# EAGLE design dongle (EAGLE 6.4)
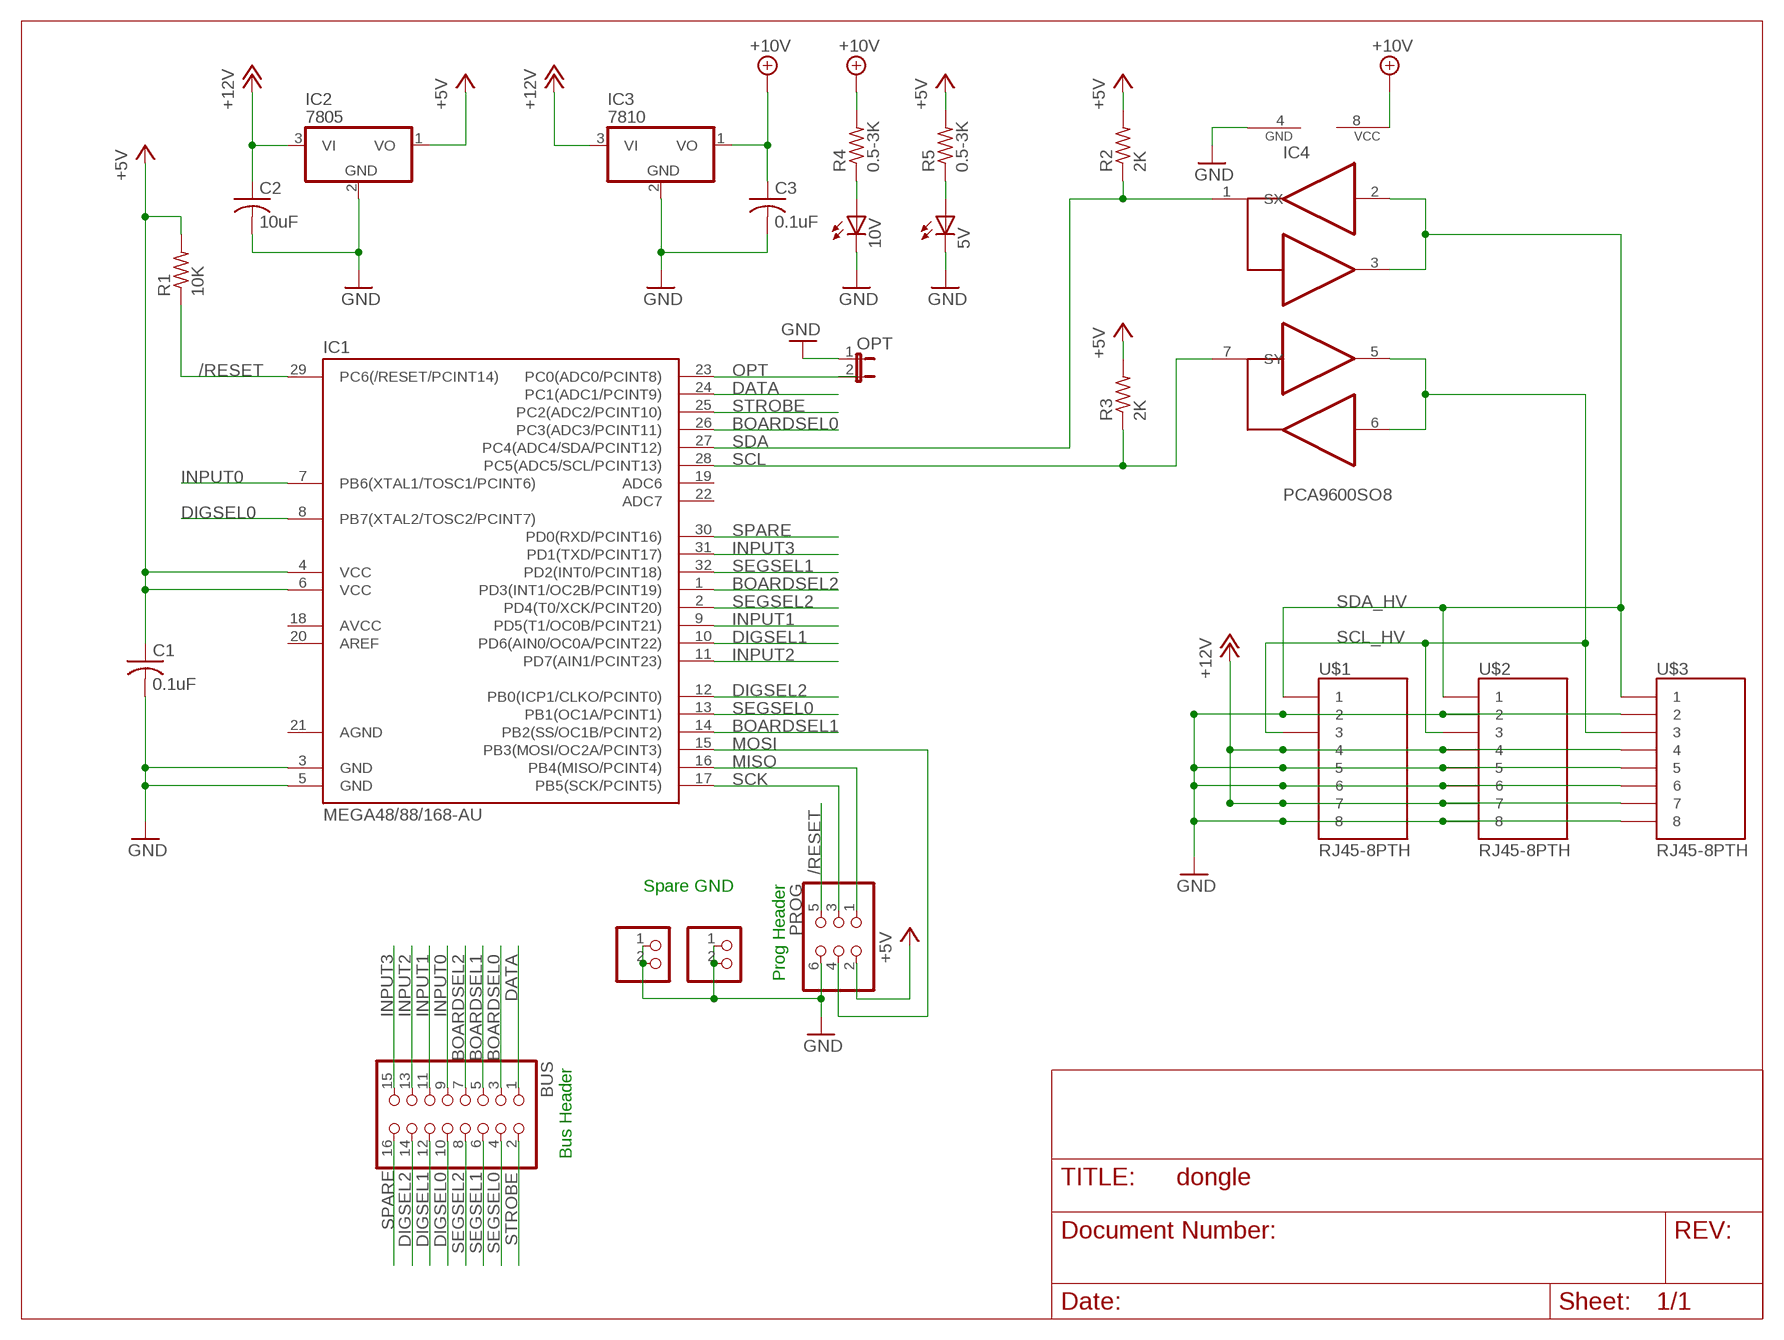
[diagram p0: schematic, sheet 1]

## Parts
5V  LED3MM  [LED3MM]
10V  LED3MM  [LED3MM]
BUS  PINHD-2X8  [2X08]
C1  0.1uF  C-US025-025X050  [C025-025X050]
C2  10uF  C-US025-025X050  [C025-025X050]
C3  0.1uF  C-US025-025X050  [C025-025X050]
GROUND1  PINHD-1X2  [1X02]
GROUND2  PINHD-1X2  [1X02]
IC1  MEGA48/88/168-AU  [TQFP32-08]
IC2  7805  78L05Z  [TO92]
IC3  7810  78L05Z  [TO92]
IC4  PCA9600SO8  [SO08]
OPT  JUMPER-2PTH  [1X02]
PROG  PINHD-2X3  [2X03]
R1  10K  R-US_0204/5  [0204/5]
R2  2K  R-US_0204/5  [0204/5]
R3  2K  R-US_0204/5  [0204/5]
R4  0.5-3K  R-US_0204/5  [0204/5]
R5  0.5-3K  R-US_0204/5  [0204/5]
U$1  RJ45-8PTH  [RJ45-8]
U$2  RJ45-8PTH  [RJ45-8]
U$3  RJ45-8PTH  [RJ45-8]

## Nets
+5V [power]: C1.1 IC1.4(VCC) IC1.6(VCC) IC2.1(VO) PROG.2 R1.2 R2.2 R3.2 R5.2
+10V [power]: C3.1 IC3.1(VO) IC4.8(VCC) R4.2
+12V [power]: C2.1 IC2.3(VI) IC3.3(VI) U$1.4 U$1.7 U$2.4 U$2.7 U$3.4 U$3.7
/RESET: IC1.29(PC6(/RESET/PCINT14)) PROG.5 R1.1
BOARDSEL0: BUS.3 IC1.26(PC3(ADC3/PCINT11))
BOARDSEL1: BUS.5 IC1.14(PB2(SS/OC1B/PCINT2))
BOARDSEL2: BUS.7 IC1.1(PD3(INT1/OC2B/PCINT19))
DATA: BUS.1 IC1.24(PC1(ADC1/PCINT9))
DIGSEL0: BUS.10 IC1.8(PB7(XTAL2/TOSC2/PCINT7))
DIGSEL1: BUS.12 IC1.10(PD6(AIN0/OC0A/PCINT22))
DIGSEL2: BUS.14 IC1.12(PB0(ICP1/CLKO/PCINT0))
GND [power]: 5V.K(C) 10V.K(C) C1.2 C2.2 C3.2 GROUND1.1 GROUND1.2 GROUND2.1 GROUND2.2 IC1.3(GND) IC1.5(GND) IC2.2(GND) IC3.2(GND) IC4.4(GND) OPT.1 PROG.6 U$1.2 U$1.5 U$1.6 U$1.8 U$2.2 U$2.5 U$2.6 U$2.8 U$3.2 U$3.5 U$3.6 U$3.8
INPUT0: BUS.9 IC1.7(PB6(XTAL1/TOSC1/PCINT6))
INPUT1: BUS.11 IC1.9(PD5(T1/OC0B/PCINT21))
INPUT2: BUS.13 IC1.11(PD7(AIN1/PCINT23))
INPUT3: BUS.15 IC1.31(PD1(TXD/PCINT17))
MISO: IC1.16(PB4(MISO/PCINT4)) PROG.1
MOSI: IC1.15(PB3(MOSI/OC2A/PCINT3)) PROG.4
N$1: 5V.A R5.1
N$2: 10V.A R4.1
OPT: IC1.23(PC0(ADC0/PCINT8)) OPT.2
SCK: IC1.17(PB5(SCK/PCINT5)) PROG.3
SCL: IC1.28(PC5(ADC5/SCL/PCINT13)) IC4.7(SY) R3.1
SCL_HV: IC4.5(TY) IC4.6(RY) U$1.3 U$2.3 U$3.3
SDA: IC1.27(PC4(ADC4/SDA/PCINT12)) IC4.1(SX) R2.1
SDA_HV: IC4.2(RX) IC4.3(TX) U$1.1 U$2.1 U$3.1
SEGSEL0: BUS.4 IC1.13(PB1(OC1A/PCINT1))
SEGSEL1: BUS.6 IC1.32(PD2(INT0/PCINT18))
SEGSEL2: BUS.8 IC1.2(PD4(T0/XCK/PCINT20))
SPARE: BUS.16 IC1.30(PD0(RXD/PCINT16))
STROBE: BUS.2 IC1.25(PC2(ADC2/PCINT10))
Unconnected: IC1.18(AVCC) IC1.19(ADC6) IC1.20(AREF) IC1.22(ADC7)

## Notes on the sheet
- Spare GND
- Prog Header
- Bus Header

## Power pins joined to a net without a drawn wire
AGND: IC1.21(AGND)

## Library data of the parts
5V 10V = led:LED: LED OSRAM: - CHIPLED LG R971, LG N971, LY N971, LG Q971, LY Q971, LO R971, LY R971 LH N974, LH R974 LS Q976, LO Q976, LY Q976 LO Q996 - Hyper CHIPLED LW Q18S LB Q993, LB Q99A, LB R99A - SideLED LS A670, LO A670, LY A670, LG A670, LP A670 LB A673, LV A673, LT A673, LW A673 LH A674 LY A675 LS A676, LA A676, LO A676, LY A676, LW A676 LS A679, LY A679, LG A679 - Hyper Micro SIDELED® LS Y876, LA Y876, LO Y876, LY Y876 LT Y87S - SmartLED LW L88C, LW L88S LB L89C, LB L89S, LG L890 LS L89K, LO L89K, LY L89K LS L896, LA L896, LO L896, LY L896 - TOPLED LS T670, LO T670, LY T670, LG T670, LP T670 LSG T670, LSP T670, LSY T670, LOP T670, LYG T670 LG T671, LOG T671, LSG T671 LB T673, LV T673, LT T673, LW T673 LH T674 LS T676, LA T676, LO T676, LY T676, LB T676, LH T676, LSB T676, LW T676 LB T67C, LV T67C, LT T67C, LS T67K, LO T67K, LY T67K, LW E67C LS E67B, LA E67B, LO E67B, LY E67B, LB E67C, LV E67C, LT E67C LW T67C LS T679, LY T679, LG T679 LS T770, LO T770, LY T770, LG T770, LP T770 LB T773, LV T773, LT T773, LW T773 LH T774 LS E675, LA E675, LY E675, LS T675 LS T776, LA T776, LO T776, LY T776, LB T776 LHGB T686 LT T68C, LB T68C - Hyper Mini TOPLED® LB M676 - Mini TOPLED Santana® LG M470 LS M47K, LO M47K, LY M47K Source: http://www.osram.convergy.de LUXEON: - LUMILED® LXK2-PW12-R00, LXK2-PW12-S00, LXK2-PW14-U00, LXK2-PW14-V00 LXK2-PM12-R00, LXK2-PM12-S00, LXK2-PM14-U00 LXK2-PE12-Q00, LXK2-PE12-R00, LXK2-PE12-S00, LXK2-PE14-T00, LXK2-PE14-U00 LXK2-PB12-K00, LXK2-PB12-L00, LXK2-PB12-M00, LXK2-PB14-N00, LXK2-PB14-P00, LXK2-PB14-Q00 LXK2-PR12-L00, LXK2-PR12-M00, LXK2-PR14-Q00, LXK2-PR14-R00 LXK2-PD12-Q00, LXK2-PD12-R00, LXK2-PD12-S00 LXK2-PH12-R00, LXK2-PH12-S00 LXK2-PL12-P00, LXK2-PL12-Q00, LXK2-PL12-R00 Source: www.luxeon.com KINGBRIGHT: KA-3528ASYC Source: www.kingbright.com
BUS = pinhead:PINHD-2X8: PIN HEADER
C1-C3 = rcl:C-US: CAPACITOR, American symbol
GROUND1 GROUND2 = pinhead:PINHD-1X2: PIN HEADER
IC1 = avr-4:MEGA48/88/168
IC2 IC3 = linear:78*: Positive VOLTAGE REGULATOR Source: http://cache.national.com/ds/LM/LM78L05.pdf http://www.fairchildsemi.com/ds/LM/LM7805.pdf
IC4 = 4534_I2C2:PCA9600: I2C ACTIVE TERMINATOR SO-8
OPT = SparkFun:JUMPER-2: Jumper Basic 0.1" spaced jumper. Use with breakaway headers.
PROG = pinhead:PINHD-2X3: PIN HEADER
R1-R5 = rcl:R-US_: RESISTOR, American symbol
U$1-U$3 = SparkFun:RJ45-8: RJ45 Jack Simple RJ45, 8-pin connection - connector for common Cat5, Cat5e, and Cat6 Ethernet cables. Footprint not yet proven in production. Connector sku is PRT-00643; Breakout PCB sku is BOB-00716.

## Net classes
0 default: width 0.152 mm, drill 0.152 mm, clearance 0.152 mm
1 power: width 0.305 mm, drill 0.305 mm, clearance 0.152 mm to class 0, clearance 0.152 mm

## Board
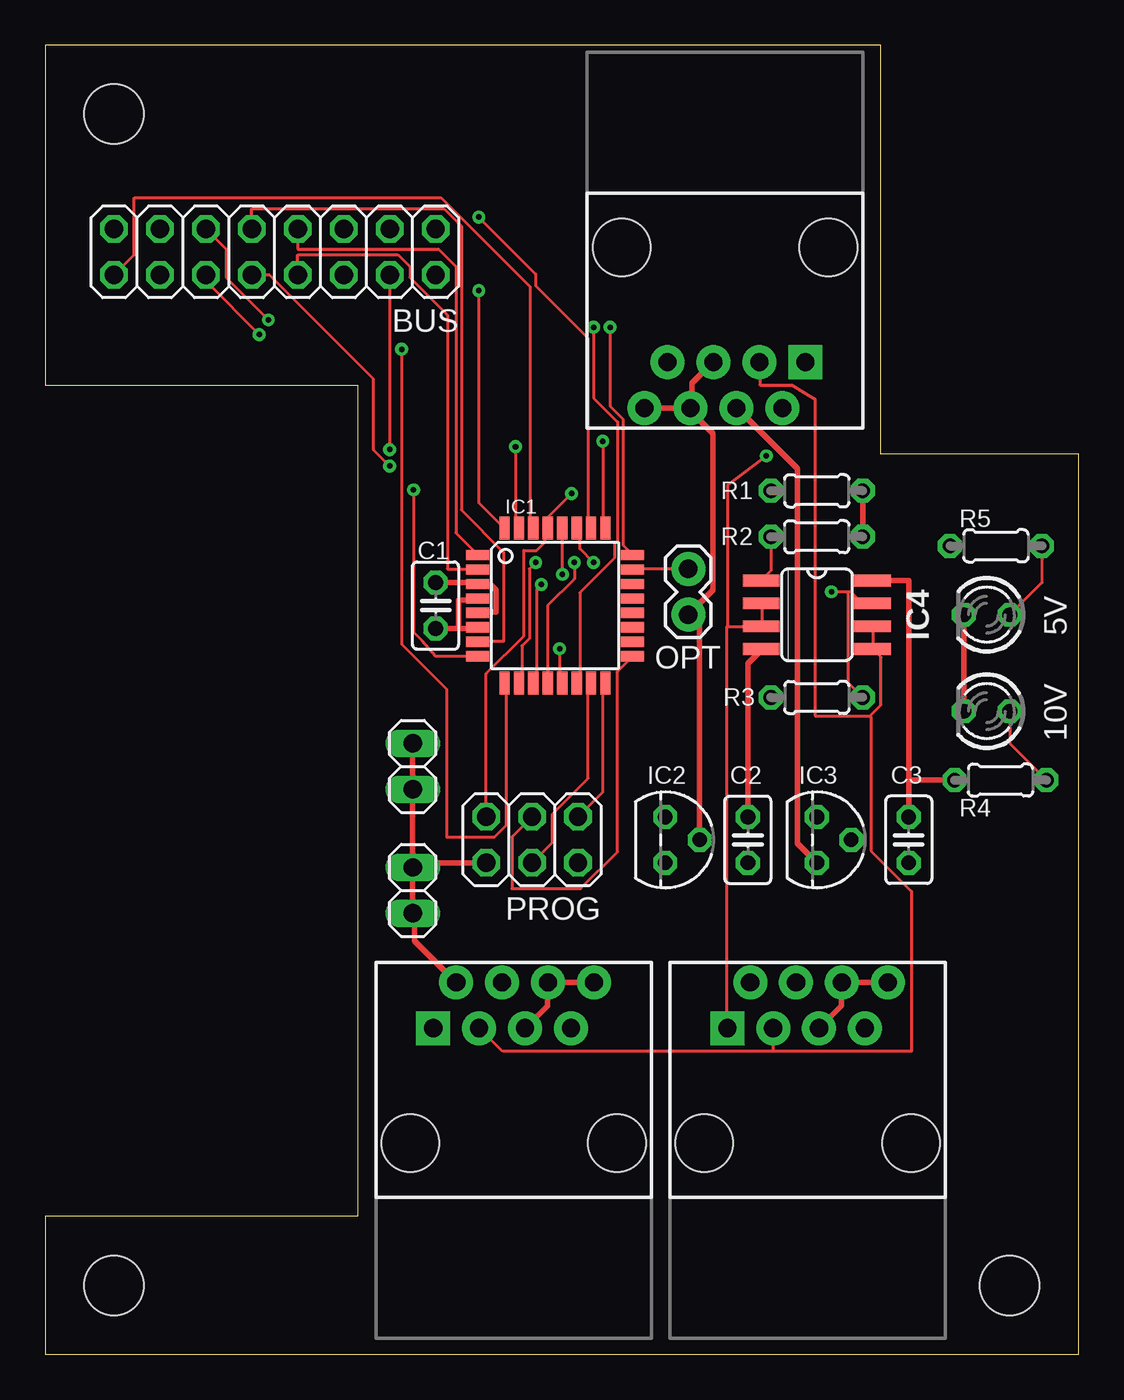
[diagram p1: board, top side]
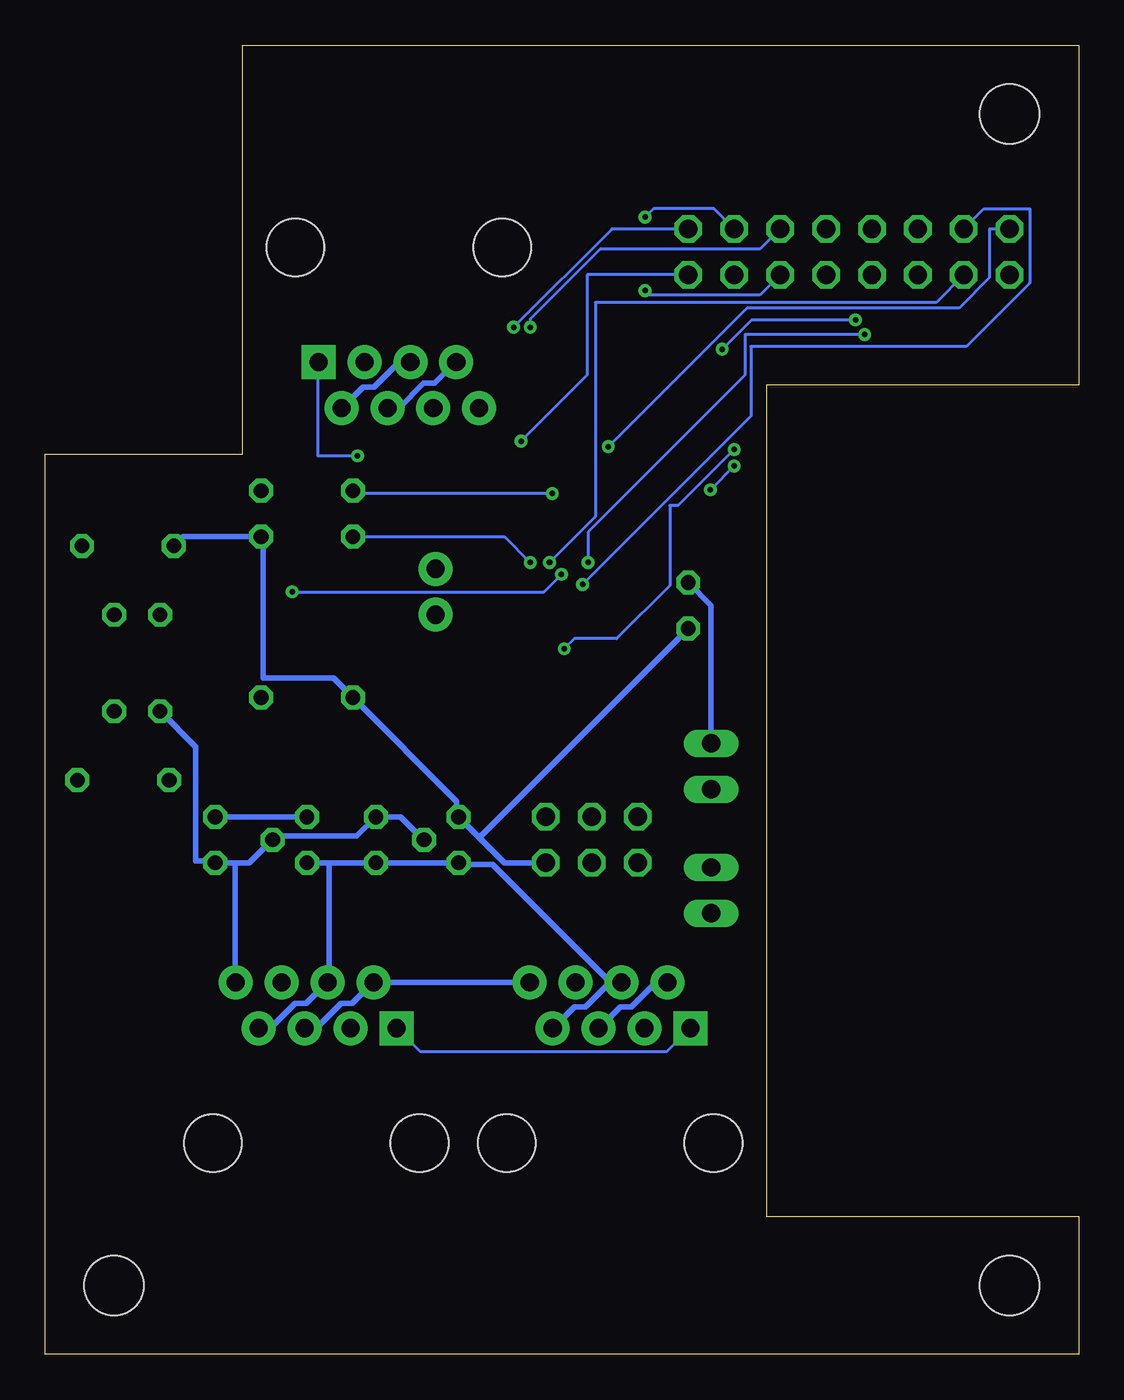
[diagram p2: board, bottom side, seen from below]

Size 57.15 x 72.39 mm. Coordinates in mm from the lower left corner, seen from the top.
Outline: 0,0 57.15,0 57.15,49.78 46.23,49.78 46.23,72.39 0,72.39 0,53.59 17.27,53.59 17.27,7.62 0,7.62 0,0
Copper layers (1*16): Top 0.035mm / dielectric 1.5mm / Bottom 0.035mm
Design rules "default *": minimum track width 6mil, minimum drill 12mil, track to track 6mil, track to pad 10mil, pad to pad 8mil, via to via 8mil, smd to smd 6mil, copper to edge 30mil, drill to drill 8mil, minimum pad ring 10mil, minimum via ring 8mil, stop-mask expansion 4mil, vias tented up to drill 13mil, thermal gap 10mil
tRestrict: area 14.7,35.8 to 21.8,36.6
vRestrict: area 2,57.7 to 23.6,64.3

### Footprints (pad centres in the part's own frame; a part is rotated, then mirrored left to right if it is on the bottom)
LED3MM = drill 0.813 octagon: A -1.27,0; K 1.27,0
2X08 = drill 1.016 octagon: 1 -8.89,-1.27; 2 -8.89,1.27; 3 -6.35,-1.27; 4 -6.35,1.27; 5 -3.81,-1.27; 6 -3.81,1.27; 7 -1.27,-1.27; 8 -1.27,1.27; 9 1.27,-1.27; 10 1.27,1.27; 11 3.81,-1.27; 12 3.81,1.27; 13 6.35,-1.27; 14 6.35,1.27; 15 8.89,-1.27; 16 8.89,1.27
C025-025X050 = drill 0.813 octagon: 1 -1.27,0; 2 1.27,0
1X02 = drill 1.016 long: 1 -1.27,0; 2 1.27,0
TQFP32-08 = smd 1.27 x 0.559: 1 -4.293,2.8; 2 -4.293,2; 3 -4.293,1.2; 4 -4.293,0.4; 5 -4.293,-0.4; 6 -4.293,-1.2; 7 -4.293,-2; 8 -4.293,-2.8; 17 4.293,-2.8; 18 4.293,-2; 19 4.293,-1.2; 20 4.293,-0.4; 21 4.293,0.4; 22 4.293,1.2; 23 4.293,2; 24 4.293,2.8 | smd 0.559 x 1.27: 9 -2.8,-4.293; 10 -2,-4.293; 11 -1.2,-4.293; 12 -0.4,-4.293; 13 0.4,-4.293; 14 1.2,-4.293; 15 2,-4.293; 16 2.8,-4.293; 25 2.8,4.293; 26 2,4.293; 27 1.2,4.293; 28 0.4,4.293; 29 -0.4,4.293; 30 -1.2,4.293; 31 -2,4.293; 32 -2.8,4.293
TO92 = drill 0.813 octagon: 1 -1.27,0; 2 0,1.905; 3 1.27,0
SO08 = smd 0.66 x 2.032: 1 -1.905,-3.073; 2 -0.635,-3.073; 3 0.635,-3.073; 4 1.905,-3.073; 5 1.905,3.073; 6 0.635,3.073; 7 -0.635,3.073; 8 -1.905,3.073
1X02' = drill 1.016 pad 1.88: 1 0,0; 2 2.54,0
2X03 = drill 1.016 octagon: 1 -2.54,-1.27; 2 -2.54,1.27; 3 0,-1.27; 4 0,1.27; 5 2.54,-1.27; 6 2.54,1.27
0204/5 = drill 0.813 octagon: 1 -2.54,0; 2 2.54,0
RJ45-8 = drill 1 pad 1.88 square: 1 -4.445,6.35 | drill 1 pad 1.88: 2 -3.175,8.89; 3 -1.905,6.35; 4 -0.635,8.89; 5 0.635,6.35; 6 1.905,8.89; 7 3.175,6.35; 8 4.445,8.89 | hole 3.2: -5.715,0; 5.715,0
STAND-OFF = hole 3.302: 0,0

### Placement (x,y rotation side)
5V  52.07,40.89 180 top
10V  52.07,35.56 180 top
BUS  12.7,60.96 180 top
C1  21.59,41.4 90 top
C2  38.86,28.45 90 top
C3  47.75,28.45 270 top
GROUND1  20.32,25.65 90 top
GROUND2  20.32,32.51 90 top
IC1  28.19,41.4 0 top
IC2  34.29,28.45 270 top
IC3  42.67,28.45 270 top
IC4  42.67,40.89 270 top
OPT  [1X02']  35.56,40.89 90 top
PROG  26.92,28.45 180 top
R1  42.67,47.75 0 top
R2  42.67,45.21 0 top
R3  42.67,36.32 180 top
R4  52.83,31.75 180 top
R5  52.58,44.7 180 top
U$1  42.16,11.68 0 top
U$2  37.59,61.21 180 top
U$3  25.91,11.68 0 top
U$5  [STAND-OFF]  3.81,68.58 0 top
U$6  [STAND-OFF]  3.81,3.81 0 top
U$7  [STAND-OFF]  53.34,3.81 0 top

### Tracks (layer width: path | path; a pad name or v marks a point on that pad's centre or on a via)
+5V
  Top 0.305: R1.2 R2.2 | 23.93,41.81 IC1.4 23.77,41.71 22.86,41.71 22.86,40.13 | 23.93,40.23 IC1.6 23.77,40.13 22.86,40.13 | C1.1 22.86,40.13
  Bottom 0.305: R5.2 49.53,45.21 R2.2 45.11,45.11 45.11,37.39 41.2,37.39 R3.2 34.39,30.58 34.39,29.82 IC2.1 33.17,28.6 | 33.17,28.6 31.75,27.18 PROG.2 | C1.1 33.02,28.7 33.07,28.7 33.17,28.6
+10V
  Top 0.305: C3.1 47.75,31.75 | 47.75,31.75 47.75,42.77 45.77,42.77 IC4.8 | 47.75,31.75 R4.2
  Bottom 0.305: C3.1 IC3.1
+12V
  Top 0.305: IC3.3 41.6,28.25 41.6,48.97 38.25,52.32 U$2.4
  Bottom 0.305: U$2.4 37.59,52.32 36.22,53.7 35.61,53.7 34.44,54.86 U$2.7 | U$3.7 29.06,18.03 27.89,19.2 27.28,19.2 25.91,20.57 U$3.4 26.01,20.68 32.41,27.08 34.19,27.08 IC2.3 C2.1 41.45,27.18 | 41.45,27.18 IC3.3 | U$1.7 44.7,18.03 43.33,19.41 42.72,19.41 41.55,20.57 U$1.4 41.45,20.68 41.45,27.18
/RESET  (via drill 0.3)
  Top 0.152: PROG.5 24.38,37.64 26.47,39.73 26.47,44.45 27.18,44.45 27.64,44.91 27.64,45.52 27.79,45.67 IC1.29 27.79,45.77 27.79,46.28 v29.11,47.6
  Bottom 0.152: R1.1 39.98,47.6 v29.11,47.6
BOARDSEL0  (via drill 0.3)
  Top 0.152: v23.98,62.89 27.13,59.74 27.13,59.08 30.02,56.19 30.02,45.87 30.18,45.72 IC1.26
  Bottom 0.152: v23.98,62.89 23.52,63.35 20.17,63.35 BUS.3
BOARDSEL1  (via drill 0.3)
  Top 0.152: v30.33,56.79 30.33,52.88 31.65,51.56 31.65,44.96 31.5,44.81 31.5,44.04 29.57,42.11 29.57,37.29 29.41,37.13 IC1.14
  Bottom 0.152: v30.33,56.79 30.33,57.25 26.47,61.11 17.63,61.11 BUS.5
BOARDSEL2
  Top 0.152: BUS.7 13.97,61.11 21.74,61.11 22.71,60.15 22.71,45.41 23.88,44.25 IC1.1
DATA  (via drill 0.3)
  Top 0.152: v31.24,56.79 31.24,52.43 31.95,51.71 31.95,44.76 32.46,44.25 IC1.24
  Bottom 0.152: v31.24,56.79 25.81,62.23 BUS.1
DIGSEL0  (via drill 0.3)
  Top 0.152: v20.37,47.8 20.37,39.93 20.83,39.47 21.59,38.61 23.88,38.61 IC1.8 | v19.05,49.12 18.14,50.04 18.14,53.95 12.39,59.69 BUS.10
  Bottom 0.152: v19.05,49.12 v20.37,47.8
DIGSEL1  (via drill 0.3)
  Top 0.152: v27.13,43.79 26.77,43.43 26.77,39.57 26.36,39.17 26.36,37.29 26.21,37.13 IC1.10 | v11.84,56.39 8.89,59.33 BUS.12
  Bottom 0.152: v27.13,43.79 27.13,45.47 18.44,54.15 18.44,56.39 v11.84,56.39
DIGSEL2  (via drill 0.3)
  Top 0.152: v29.26,43.79 29.26,42.88 27.79,41.4 27.79,37.13 IC1.12
  Bottom 0.152: v29.26,43.79 26.72,46.33 26.72,58.17 7.87,58.17 BUS.14
GND
  Top 0.305: 23.93,41.05 IC1.5 24.08,41.05 24.94,41.05 24.94,42.27 24.64,42.57 23.93,42.57 IC1.3 | 23.93,42.62 IC1.3 | C1.2 23.77,42.67 IC1.3 | GROUND2.2 GROUND2.1 GROUND1.2 | U$3.5 26.57,18.03 27.79,19.25 27.79,20.57 U$3.6 U$3.8 | GROUND1.2 GROUND1.1 20.42,24.28 20.42,22.86 22.71,20.57 U$3.2 | PROG.6 20.42,27.18 20.42,27.03 GROUND1.2 | 5V.K 10V.K | U$1.5 42.82,18.03 44.04,19.25 44.04,20.57 U$1.6 U$1.8 | U$2.6 U$2.8 | U$2.5 36.93,54.86 35.76,53.7 35.76,52.43 U$2.6 | 39.62,39.01 IC4.4 39.52,38.86 38.86,38.2 C2.2 | IC2.2 36.17,28.45 36.17,40.28 OPT.1 36.93,42.27 36.93,50.9 35.66,52.17 U$2.6
  Bottom 0.305: C1.2 20.32,41.4 GROUND2.2 | U$3.2 23.37,20.57 24.74,19.2 25.35,19.2 26.52,18.03 U$3.5 | 46.63,27.18 C3.2 47.85,27.28 48.82,27.28 48.82,33.58 10V.K | 46.63,27.18 45.87,27.18 44.6,28.45 IC3.2 44.45,28.5 44.3,28.65 39.93,28.65 C2.2 37.49,29.72 36.22,28.45 IC2.2 | U$1.5 42.16,18.03 40.79,19.41 40.18,19.41 39.01,20.57 U$1.2 U$3.8 | 46.63,27.18 46.63,20.57 U$1.8 | U$2.5 37.59,54.86 38.96,53.49 39.57,53.49 40.74,52.32 U$2.2
INPUT0
  Top 0.152: BUS.9 11.43,63.35 22.05,63.35 23.01,62.38 23.01,46.69 25.35,44.35 25.35,39.42 23.93,39.42 IC1.7
INPUT1  (via drill 0.3)
  Top 0.152: v19.71,55.58 19.71,39.27 22.2,36.78 22.2,28.6 24.84,28.6 25.5,29.26 25.5,36.98 25.4,37.08 IC1.9 | v12.34,57.2 10.01,59.54 10.01,61.11 BUS.11
  Bottom 0.152: v19.71,55.58 18.09,57.2 v12.34,57.2
INPUT2  (via drill 0.3)
  Top 0.152: v27.43,42.57 27.18,42.32 27.18,37.29 27.03,37.13 IC1.11
  Bottom 0.152: v27.43,42.57 18.14,51.87 18.14,55.73 6.2,55.73 2.69,59.23 2.69,63.35 5.23,63.35 BUS.13
INPUT3  (via drill 0.3)
  Top 0.152: v26.01,50.19 26.01,45.87 26.16,45.72 IC1.31
  Bottom 0.152: v26.01,50.19 18.34,57.86 6.6,57.86 4.93,59.54 4.93,62.23 BUS.15
MISO
  Top 0.152: PROG.1 30.84,31.09 30.84,36.93 30.99,37.08 IC1.16
MOSI
  Top 0.152: PROG.4 28.04,28.3 28.04,29.87 30.02,31.85 30.02,36.93 30.18,37.08 IC1.15
N$1
  Top 0.152: 5V.A 55.12,42.67 R5.1
N$2
  Top 0.152: R4.1 53.34,33.78 10V.A
OPT
  Top 0.152: OPT.2 32.51,43.43 IC1.23
SCK
  Top 0.152: PROG.3 25.81,28.6 25.81,25.76 29.62,25.76 31.65,27.79 31.65,37.74 32.46,38.56 IC1.17
SCL  (via drill 0.3)
  Top 0.152: v28.6,43.13 28.6,45.67 IC1.28 | 44.4,42.16 44.55,42.16 45.16,41.55 45.72,41.55 IC4.7 | 44.4,42.16 v43.48,42.16 | R3.1 44.4,37.13 44.4,42.16
  Bottom 0.152: v28.6,43.13 29.57,42.16 v43.48,42.16
SCL_HV
  Top 0.152: 40.23,16.76 25.3,16.76 24.03,18.03 U$3.3 | 40.23,16.76 40.23,18.03 U$1.3 | IC4.6 45.77,40.23 45.77,39.01 IC4.5 45.82,38.96 46.23,38.56 46.23,35.92 45.62,35.31 | 45.62,35.31 42.57,35.31 42.57,52.83 41.3,53.59 39.52,53.59 39.52,54.86 U$2.3 | 40.23,16.76 47.9,16.76 47.9,25.6 45.67,27.84 45.67,35.26 45.62,35.31
SDA  (via drill 0.3)
  Top 0.152: v30.33,43.79 29.57,44.55 29.57,45.52 29.41,45.67 IC1.27 | IC4.1 40.13,43.33 R2.1
  Bottom 0.152: v30.33,43.79 31.75,45.21 R2.1
SDA_HV  (via drill 0.3)
  Top 0.152: IC4.2 39.62,41.5 39.62,40.28 IC4.3 39.57,40.23 37.74,40.23 | 37.74,40.23 37.69,40.23 37.69,18.03 U$1.1 | v39.88,49.68 37.74,48.06 37.74,40.23
  Bottom 0.152: U$3.1 21.49,18.03 22.76,16.76 36.42,16.76 37.69,18.03 U$1.1 | v39.88,49.68 42.06,49.68 42.06,54.86 U$2.1
SEGSEL0  (via drill 0.3)
  Top 0.152: v28.45,39.01 28.45,37.24 28.55,37.13 IC1.13 | BUS.4 v19.05,50.04
  Bottom 0.152: v28.45,39.01 27.89,39.57 25.55,39.57 22.61,42.52 22.61,46.94 22.15,46.94 v19.05,50.04
SEGSEL1  (via drill 0.3)
  Top 0.152: v23.98,58.83 23.98,47.09 25.35,45.72 IC1.32
  Bottom 0.152: v23.98,58.83 23.72,58.57 17.63,58.57 BUS.6
SEGSEL2
  Top 0.152: BUS.8 13.97,60.81 19.51,60.81 20.17,60.15 20.17,59.54 22.25,57.45 22.25,43.43 23.88,43.43 IC1.2
SPARE
  Top 0.152: BUS.16 4.93,60.81 4.93,63.96 21.89,63.96 26.82,59.03 26.82,45.87 26.98,45.72 IC1.30
STROBE  (via drill 0.3)
  Top 0.152: v30.84,50.49 30.84,45.87 30.99,45.72 IC1.25
  Bottom 0.152: v30.84,50.49 27.18,54.15 27.18,59.69 BUS.2

### Text on the board
tDocu: EXPERIMENTAL | Not certified for flight / beyond termination shock | TX | 1 | RX | 1 | GND | GND | EPB-I2C Dongle Rev B | Oct 2017